# EasyEDA schematic Hardverski_dizajn_ver2.json
TITLE: Dizajn IoT uredjaja; REV: 1.0; Date: 2026-09-10; Sheet: 1/1; Drawn By: esmajun; Company: Your Company
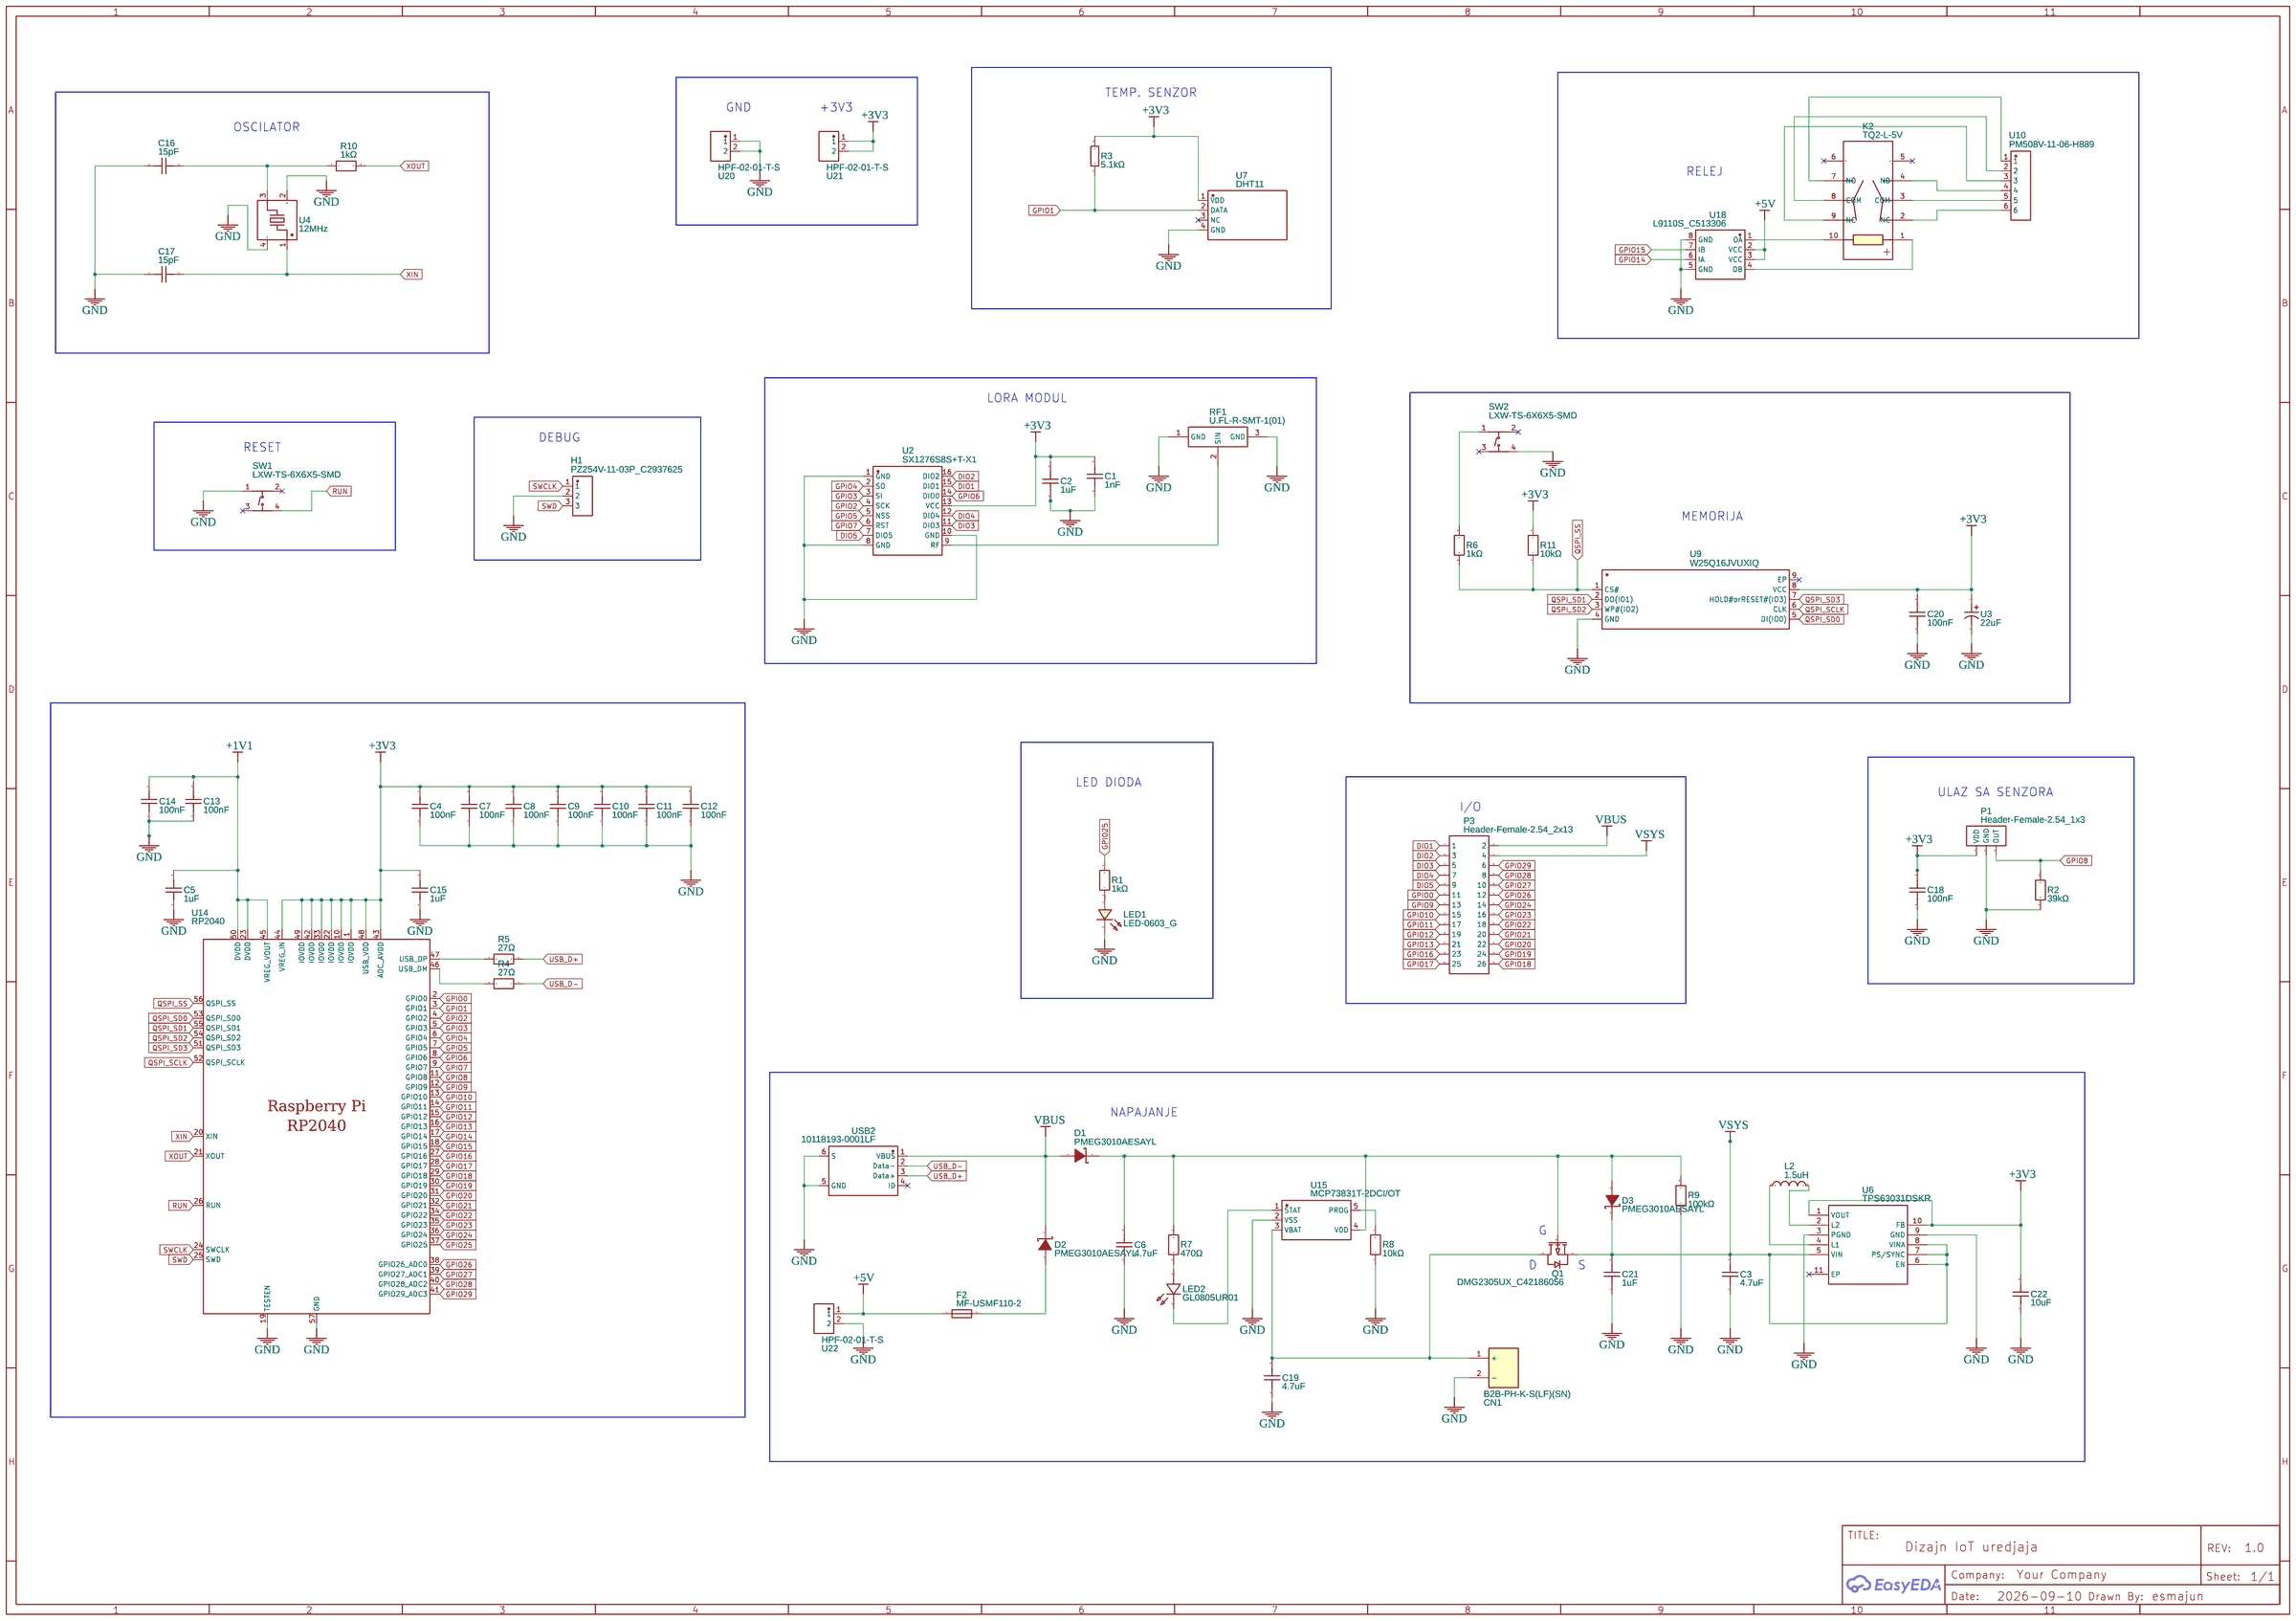
[diagram p0: schematic sheet]

## Parts
C1  1nF  [C0805]
C2  1uF  [C0805]
C3  4.7uF  [C0805]
C4  100nF  [C0805]
C5  1uF  [C0805]
C6  4.7uF  [C0805]
C7  100nF  [C0805]
C8  100nF  [C0805]
C9  100nF  [C0805]
C10  100nF  [C0805]
C11  100nF  [C0805]
C12  100nF  [C0805]
C13  100nF  [C0805]
C14  100nF  [C0805]
C15  1uF  [C0805]
C16  15pF  [C0805]
C17  15pF  [C0805]
C18  100nF  [C0805]
C19  4.7uF  [C0805]
C20  100nF  [C0805]
C21  1uF  [C0805]
C22  10uF  [C0805]
CN1  B2B-PH-K-S(LF)(SN)  [CONN-TH_B2B-PH-K-S]
D1  PMEG3010AESAYL  [SOD995_L1.0-W0.6-RD_PMEG3010AESAYL]
D2  PMEG3010AESAYL  [SOD995_L1.0-W0.6-RD_PMEG3010AESAYL]
D3  PMEG3010AESAYL  [SOD995_L1.0-W0.6-RD_PMEG3010AESAYL]
F2  MF-USMF110-2  [F1210]
H1  PZ254V-11-03P_C2937625  [HDR-TH_3P-P2.54-V-M_PZ254V-11-03P]
K2  TQ2-L-5V  [RELAY-TH_TQ2-XXV]
L2  1.5uH  [IND-SMD_L2.0-W1.6]
LED1  LED-0603_G  [LED0603_GREEN]
LED2  GL0805UR01  [LED0805-R-RD_RED]
P1  Header-Female-2.54_1x3  [HDR-TH_3P-P2.54-V-F]
P3  Header-Female-2.54_2x13  [HDR-TH_26P-P2.54-V-F-R2-C13-S2.54-1]
Q1  DMG2305UX_C42186056  [SOT-23-3_L2.9-W1.3-P1.90-LS2.4-BR]
R1  1kΩ  [R0805]
R2  39kΩ  [R0805]
R3  5.1kΩ  [R0805]
R4  27Ω  [R0805]
R5  27Ω  [R0805]
R6  1kΩ  [R0805]
R7  470Ω  [R0805]
R8  10kΩ  [R0805]
R9  100kΩ  [R0805]
R10  1kΩ  [R0805]
R11  10kΩ  [R0805]
RF1  U.FL-R-SMT-1(01)  [RF-SMD_U.FL-R-SMT-1-80]
SW1  LXW-TS-6X6X5-SMD  [SW-SMD_4P-L6.0-W6.0-P4.50-LS7.2]
SW2  LXW-TS-6X6X5-SMD  [SW-SMD_4P-L6.0-W6.0-P4.50-LS7.2]
U2  SX1276S8S+T-X1  [WIRELM-SMD_SX1278S165SY-T-X1]
U3  22uF  [CAP-SMD_BD6.3-L6.6-W6.6-LS7.3-FD]
U4  12MHz  [CRYSTAL-SMD_4P-L3.2-W2.5-BL]
U6  TPS63031DSKR  [SON-10_L2.5-W2.5-P0.50-TL-EP]
U7  DHT11  [SENSOR-TH_DHT11]
U9  W25Q16JVUXIQ  [USON-8_L3.0-W2.0-P0.50-BL-EP]
U10  PM508V-11-06-H889  [CONN-TH_PM508V-11-06-H889]
U14  RP2040  [LQFN-56_L7.0-W7.0-P0.4-EP]
U15  MCP73831T-2DCI/OT  [SOT-23-5_L2.9-W1.6-P0.95-LS2.8-BL]
U18  L9110S_C513306  [SOP-8_L4.9-W3.9-P1.27-LS6.0-BL]
U20  HPF-02-01-T-S  [HDR-TH_2P-P5.08-V-F-R2-C2_HPF-02-01-X-S]
U21  HPF-02-01-T-S  [HDR-TH_2P-P5.08-V-F-R2-C2_HPF-02-01-X-S]
U22  HPF-02-01-T-S  [HDR-TH_2P-P5.08-V-F-R2-C2_HPF-02-01-X-S]
USB2  10118193-0001LF  [MICRO-USB-SMD_10118193-0001LF]

## Library data of the parts
C1-C22 = C_0805_US: Contributor: LCEDA_Lib
CN1 = B2B-PH-K-S(LF)(SN): Contributor: LCSC; Supplier: LCSC; Manufacturer: JST; Supplier Part: C131337; JLCPCB Part Class: Extended Part
D1-D3 = PMEG3010AESAYL: Contributor: LCSC; Supplier: LCSC; Supplier Part: C552857; Manufacturer: Nexperia(安世); JLCPCB Part Class: Extended Part
F2 = MF-USMF110-2: Contributor: LCSC; Supplier: LCSC; Supplier Part: C210833; Manufacturer: BOURNS; JLCPCB Part Class: Extended Part
H1 = PZ254V-11-03P_C2937625: Contributor: LCSC; Supplier: LCSC; Supplier Part: C2937625; Manufacturer: XFCN(兴飞); Manufacturer Part: PZ254V-11-03P; JLCPCB Part Class: Extended Part
K2 = TQ2-L-5V: Contributor: lcsc; Supplier: LCSC; Supplier Part: C4402946; Manufacturer: PANASONIC(松下); JLCPCB Part Class: Extended Part
L2 = SLW201610P1R5MST: Contributor: LCSC; Supplier: LCSC; Supplier Part: C207859; Manufacturer: Sunltech(顺磁); JLCPCB Part Class: Extended Part
LED1 = LED-0603_G: Manufacturer: EVERLIGHT(台湾亿光); Manufacturer Part: 19-217/GHC-YR1S2/3T; Supplier Part: C72043; Supplier: LCSC; Contributor: LCEDA_Lib
LED2 = GL0805UR01: Supplier: LCSC; Supplier Part: C51933307; Manufacturer: Guiguang light(桂光光电); JLCPCB Part Class: Extended Part; Contributor: lcsc
P1 = Header-Female-2.54_1x3: Supplier Part: C146243; Supplier: LCSC; Manufacturer: BOOMELE(博穆精密); Manufacturer Part: 2.54-1*3P母; JLCPCB Part Class: Extended Part
P3 = Header-Female-2.54_2x13: Supplier: LCSC; Manufacturer: BOOMELE(博穆精密); Manufacturer Part: 2.54-2*13P母; Supplier Part: C64320; JLCPCB Part Class: Extended Part
Q1 = DMG2305UX_C42186056: Supplier: LCSC; Supplier Part: C42186056; Manufacturer: GOODWORK(固得沃克); Manufacturer Part: DMG2305UX; Contributor: lcsc
R1 R2 R4-R11 = R_0805_EU: Contributor: LCEDA_Lib
R3 = RMC08055.1K5%N: Contributor: LCSC; Supplier: LCSC; Supplier Part: C269736; Manufacturer: Tyohm(幸亚电阻); JLCPCB Part Class: Extended Part
RF1 = U.FL-R-SMT-1(01): Contributor: LCSC; Supplier: LCSC; Supplier Part: C598199; Manufacturer: HRS(广濑); JLCPCB Part Class: Extended Part
SW1 SW2 = LXW-TS-6X6X5-SMD: Supplier: LCSC; Supplier Part: C53447020; Manufacturer: LXWCONN(连兴旺电子); Contributor: lcsc; JLCPCB Part Class: Extended Part; link: https://lcsc.com/eda_search?q=C53447020&%26type=1&ref=editor
U2 = SX1276S8S+T-X1: Contributor: LCSC; Supplier: LCSC; Supplier Part: C718834; Manufacturer: Vollgo(沃进); JLCPCB Part Class: Extended Part
U3 = 189RV0020: Supplier: LCSC; Supplier Part: C7471882; Manufacturer: KNSCHA(科尼盛); JLCPCB Part Class: Extended Part; Contributor: lcsc
U4 = ABM8-272-T3_C20625731: Supplier: LCSC; Supplier Part: C20625731; Manufacturer: ABRACON; Manufacturer Part: ABM8-272-T3; JLCPCB Part Class: Extended Part; Contributor: lcsc
U6 = TPS63031DSKR: Supplier: LCSC; Manufacturer: TI(德州仪器); Supplier Part: C15516; JLCPCB Part Class: Extended Part
U7 = DHT11: Contributor: LCSC; Supplier: LCSC; Supplier Part: C117051; Manufacturer: 广州奥松; JLCPCB Part Class: Extended Part
U9 = W25Q16JVUXIQ: Contributor: lcsc; Supplier: LCSC; Supplier Part: C2843335; Manufacturer: Winbond(华邦); JLCPCB Part Class: Extended Part
U10 = PM508V-11-06-H889: Supplier: LCSC; Supplier Part: C55014370; Manufacturer: XFCN(兴飞); Contributor: lcsc; JLCPCB Part Class: Extended Part
U14 = RP2040: Contributor: LCSC; Supplier: LCSC; Supplier Part: C2040; Manufacturer: Raspberry Pi(树莓派); JLCPCB Part Class: Extended Part
U15 = MCP73831T-2DCI/OT: Contributor: LCSC; Supplier: LCSC; Supplier Part: C625597; Manufacturer: MICROCHIP(美国微芯); JLCPCB Part Class: Extended Part
U18 = L9110S_C513306: Contributor: LCSC; Supplier: LCSC; Supplier Part: C513306; Manufacturer: Mixic(中科芯亿达); Manufacturer Part: L9110S; JLCPCB Part Class: Extended Part
U20-U22 = HPF-02-01-T-S: Supplier: LCSC; Supplier Part: C6269350; Manufacturer: SAMTEC; JLCPCB Part Class: Extended Part; Contributor: lcsc
USB2 = 10118193-0001LF: Contributor: LCSC; Supplier: LCSC; Supplier Part: C132562; Manufacturer: Amphenol; JLCPCB Part Class: Extended Part

## Nets
+1V1: C5.2 C13.2 C14.2 U14.23(DVDD) U14.45(VREG_VOUT) U14.50(DVDD)
+3V3: C1.2 C2.2 C4.2 C7.2 C8.2 C9.2 C10.2 C11.2 C12.2 C15.2 C18.2 C20.2 C22.2 P1.1(VDD) R3.2 R11.2 U2.13(VCC) U3.1 U6.1(VOUT) U6.10(FB) U7.1(VDD) U9.8(VCC) U14.1(IOVDD) U14.10(IOVDD) U14.22(IOVDD) U14.33(IOVDD) U14.42(IOVDD) U14.43(ADC_AVDD) U14.44(VREG_IN) U14.48(USB_VDD) U14.49(IOVDD) U21.1 U21.2
+5V: F2.1 U18.2(VCC) U18.3(VCC) U22.1
GND: C1.1 C2.1 C3.1 C4.1 C5.1 C6.1 C7.1 C8.1 C9.1 C10.1 C11.1 C12.1 C13.1 C14.1 C15.1 C16.1 C17.1 C18.1 C19.1 C20.1 C21.1 C22.1 CN1.2(-) H1.2 LED1.2 P1.2(GND) R2.1 R8.1 R9.1 RF1.1(GND) RF1.3(GND) SW1.1 SW2.4 U2.1(GND) U2.8(GND) U2.10(GND) U3.2 U4.2(GND) U4.4(GND) U6.3(PGND) U6.9(GND) U7.4(GND) U9.4(GND) U14.19(TESTEN) U14.57(GND) U15.2(VSS) U18.5(GND) U18.8(GND) U20.1 U20.2 U22.2 USB2.5(GND) USB2.6(S)
VBUS: D1.2(A) D2.1(K) P3.2 USB2.1(VBUS)
DIO1: P3.1 U2.15(DIO1)
DIO2: P3.3 U2.16(DIO2)
DIO3: P3.5 U2.11(DIO3)
DIO4: P3.7 U2.12(DIO4)
DIO5: P3.9 U2.7(DIO5)
GPIO0: P3.11 U14.2(GPIO0)
GPIO1: R3.1 U7.2(DATA) U14.3(GPIO1)
GPIO2: U2.4(SCK) U14.4(GPIO2)
GPIO3: U2.3(SI) U14.5(GPIO3)
GPIO4: U2.2(SO) U14.6(GPIO4)
GPIO5: U2.5(NSS) U14.7(GPIO5)
GPIO6: U2.14(DIO0) U14.8(GPIO6)
GPIO7: U2.6(RST) U14.9(GPIO7)
GPIO8: P1.3(OUT) R2.2 U14.11(GPIO8)
GPIO9: P3.13 U14.12(GPIO9)
GPIO10: P3.15 U14.13(GPIO10)
GPIO11: P3.17 U14.14(GPIO11)
GPIO12: P3.19 U14.15(GPIO12)
GPIO13: P3.21 U14.16(GPIO13)
GPIO14: U14.17(GPIO14) U18.6(IA)
GPIO15: U14.18(GPIO15) U18.7(IB)
GPIO16: P3.23 U14.27(GPIO16)
GPIO17: P3.25 U14.28(GPIO17)
GPIO18: P3.26 U14.29(GPIO18)
GPIO19: P3.24 U14.30(GPIO19)
GPIO20: P3.22 U14.31(GPIO20)
GPIO21: P3.20 U14.32(GPIO21)
GPIO22: P3.18 U14.34(GPIO22)
GPIO23: P3.16 U14.35(GPIO23)
GPIO24: P3.14 U14.36(GPIO24)
GPIO25: R1.2 U14.37(GPIO25)
GPIO26: P3.12 U14.38(GPIO26_ADC0)
GPIO27: P3.10 U14.39(GPIO27_ADC1)
GPIO28: P3.8 U14.40(GPIO28_ADC2)
GPIO29: P3.6 U14.41(GPIO29_ADC3)
QSPI_SCLK: U9.6(CLK) U14.52(QSPI_SCLK)
QSPI_SD0: U9.5(DI(IO0)) U14.53(QSPI_SD0)
QSPI_SD1: U9.2(DO(IO1)) U14.55(QSPI_SD1)
QSPI_SD2: U9.3(WP#(IO2)) U14.54(QSPI_SD2)
QSPI_SD3: U9.7(HOLD#orRESET#(IO3)) U14.51(QSPI_SD3)
QSPI_SS: R6.1 R11.1 U9.1(CS#) U14.56(QSPI_SS)
RUN: SW1.4 U14.26(RUN)
SWCLK: H1.1 U14.24(SWCLK)
SWD: H1.3 U14.25(SWD)
USB_D+: R5.1 USB2.3(Data+)
USB_D-: R4.1 USB2.2(Data-)
VSYS: C3.2 C21.2 D3.1(K) P3.4 Q1.2(S) U6.5(VIN) U6.6(EN) U6.7(PS/SYNC) U6.8(VINA)
XIN: C17.2 U4.1 U14.20(XIN)
XOUT: R10.2 U14.21(XOUT)
Net-(C6-2): C6.2 D1.1(K) D3.2(A) Q1.1(G) R7.2 R9.2 U15.4(VDD)
Net-(C16-2): C16.2 R10.1 U4.3
Net-(C19-2): C19.2 CN1.1(+) Q1.3(D) U15.3(VBAT)
Net-(D2-2): D2.2(A) F2.2
Net-(K2-1): K2.1 U18.4(OB)
Net-(K2-2): K2.2(NC) U10.6
Net-(K2-3): K2.3(COM) U10.5
Net-(K2-4): K2.4(NO) U10.4
Net-(K2-7): K2.7(NO) U10.1
Net-(K2-8): K2.8(COM) U10.2
Net-(K2-9): K2.9(NC) U10.3
Net-(K2-10): K2.10 U18.1(OA)
Net-(L2-1): L2.1 U6.4(L1)
Net-(L2-2): L2.2 U6.2(L2)
Net-(LED1-1): LED1.1 R1.1
Net-(LED2-1): LED2.1(A) R7.1
Net-(LED2-2): LED2.2(C) U15.1(STAT)
Net-(R4-2): R4.2 U14.46(USB_DM)
Net-(R5-2): R5.2 U14.47(USB_DP)
Net-(R6-2): R6.2 SW2.1
Net-(R8-2): R8.2 U15.5(PROG)
Net-(RF1-2): RF1.2(SIN) U2.9(RF)

Not connected (* = marked no-connect by the designer): K2 5* 6*; SW1 2* 3*; SW2 2* 3*; U6 11(EP)*; U7 3(NC)*; U9 9(EP)*; USB2 4(ID)*

## Notes on the sheet
- TEMP. SENZOR
- GND
- +3V3
- OSCILATOR
- RELEJ
- LORA MODUL
- DEBUG
- RESET
- MEMORIJA
- LED DIODA
- ULAZ SA SENZORA
- I/O
- NAPAJANJE
- G
- D
- S
